# Altium schematic sheet Barrido de parámetros y Trasiente.SchDoc
size A4
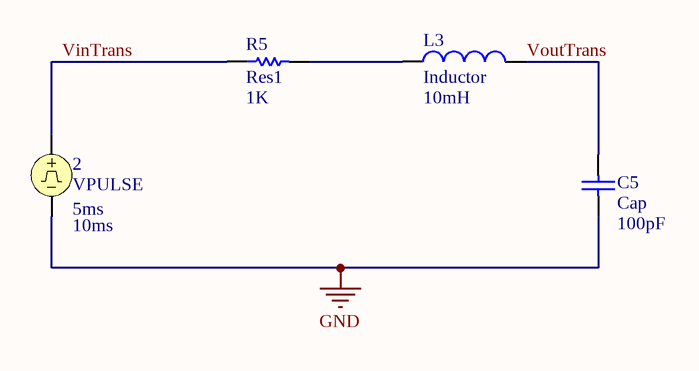
[diagram p0: Barrido de parámetros y Trasiente.SchDoc]

## Parts
2  VPULSE  Pulse Width: 5ms  Period: 10ms
C5  Cap  value 100pF  [RAD-0.3]
L3  Inductor  value 10mH  [0402-A]
R5  Res1  value 1K  [AXIAL-0.3]

## Nets
GND: 2.2 C5.1
VinTrans: 2.1 R5.1
VoutTrans: C5.2 L3.2
NetL3_1: L3.1 R5.2

## Library data of the parts
2 = VPULSE: Pulse Voltage Source; Note: PCB Footprint - Not required; Published: 8-Jun-2000; LatestRevisionDate: 15-Nov-2004; LatestRevisionNote: Corrected Netlist.; PackageReference: Not Applicable; Publisher: Altium Limited
C5 = Cap: Capacitor; Published: 8-Jun-2000; LatestRevisionDate: 17-Jul-2002; LatestRevisionNote: Re-released for DXP Platform.; PackageReference: RAD-0.3; Publisher: Altium Limited; PackageDescription: Radial Cap, Thru-Hole; 2 Leads; 0.3 in Pin Spacing
L3 = Inductor: Code_IEC: 1005; Published: 8-Jun-2000; LatestRevisionDate: 29-May-2009; LatestRevisionNote: IPC-7351 Footprint Added.; PackageReference: 0402-A; Publisher: Altium Limited; PackageDescription: Chip Inductor; Code_JEITA: 0402
R5 = Res1: Resistor; Published: 8-Jun-2000; LatestRevisionDate: 17-Jul-2002; LatestRevisionNote: Re-released for DXP Platform.; PackageReference: AXIAL-0.3; Publisher: Altium Limited; PackageDescription: Axial Device, Thru-Hole; 2 Leads; 0.3 in Pin Spacing